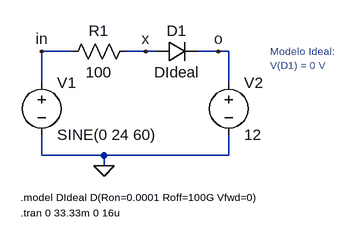
[diagram p0: schematic cargador-bateria_ideal.asc]
cargador-bateria_ideal.asc, the LTspice schematic file:
Version 4
SHEET 1 1376 680
WIRE 64 48 16 48
WIRE 176 48 144 48
WIRE 192 48 176 48
WIRE 288 48 256 48
WIRE 304 48 288 48
WIRE 16 96 16 48
WIRE 304 96 304 48
WIRE 16 208 16 176
WIRE 112 208 16 208
WIRE 304 208 304 176
WIRE 304 208 112 208
WIRE 112 224 112 208
FLAG 112 224 0
FLAG 288 48 o
FLAG 16 48 in
FLAG 176 48 x
SYMBOL diode 192 64 R270
WINDOW 0 32 32 VTop 2
WINDOW 3 0 32 VBottom 2
SYMATTR InstName D1
SYMATTR Value DIdeal
SYMBOL voltage 16 80 R0
WINDOW 123 0 0 Left 0
WINDOW 39 0 0 Left 0
SYMATTR InstName V1
SYMATTR Value SINE(0 24 60)
SYMBOL res 48 64 R270
WINDOW 0 32 56 VTop 2
WINDOW 3 0 56 VBottom 2
SYMATTR InstName R1
SYMATTR Value 100
SYMBOL voltage 304 80 R0
SYMATTR InstName V2
SYMATTR Value 12
TEXT -16 296 Left 1 !.tran 0 33.33m 0 16u
TEXT -16 272 Left 1 !.model DIdeal D(Ron=0.0001 Roff=100G Vfwd=0)
TEXT 368 48 Left 1 ;Modelo Ideal:\nV(D1) = 0 V

The netlist it stands for:
* cargador-bateria_ideal.asc
D1 x o DIdeal
V1 in 0 SINE(0 24 60)
R1 in x 100
V2 o 0 12
.model D D
.lib standard.dio
.tran 0 33.33m 0 16u
.model DIdeal D(Ron=0.0001 Roff=100G Vfwd=0)
* Modelo Ideal:
* V(D1) = 0 V
.backanno
.end